# EAGLE design adapter (EAGLE 7.6.0)
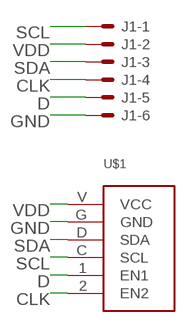
[diagram p0: schematic, sheet 1]

## Parts
J1  XF2L-0625-1  [XF2L-0625-1]
U$1  PSENSE  [PSENSE]

## Nets
CLK: J1.4 U$1.2(EN2)
D: J1.5 U$1.1(EN1)
GND: J1.6 U$1.G(GND)
SCL: J1.1 U$1.C(SCL)
SDA: J1.3 U$1.D(SDA)
VDD: J1.2 U$1.V(VCC)

## Library data of the parts
J1 = MOD_OMRON:XF2*-06?: OMRON FPC Connector Source : http://www.omron.com/ecb/products/pdf/fpc.pdf; MF: OMRON COMPONENTS USA; MPN: XF2L-0625-1; OC_FARNELL: 1536105; OC_NEWARK: 29C7842
U$1 = 445-eagle-lib:PSENSE

## Board
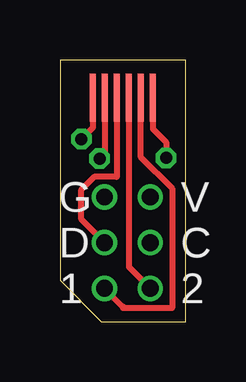
[diagram p1: board, top side]
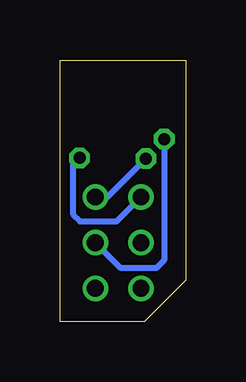
[diagram p2: board, bottom side, seen from below]

Size 5.23 x 10.91 mm. Coordinates in mm from the lower left corner, seen from the top.
Outline: 1.73,0 5.23,0 5.23,10.91 0,10.91 0,1.73 1.73,0
Copper layers (1*16): Top 0.0356mm / dielectric 1.5011mm / Bottom 0.0356mm
Design rules "LaenPCBOrder": minimum track width 6mil, minimum drill 13mil, track to track 6mil, track to pad 6mil, pad to pad 6mil, via to via 6mil, smd to smd 6mil, copper to edge 15mil, drill to drill 6mil, minimum pad ring 7mil, minimum via ring 7mil, stop-mask expansion 3mil, vias tented up to drill 0mil, thermal gap 10mil

### Footprints (pad centres in the part's own frame; a part is rotated, then mirrored left to right if it is on the bottom)
XF2L-0625-1 = smd 2 x 0.25: 1 2.405,1.25; 2 2.405,0.75; 3 2.405,0.25; 4 2.405,-0.25; 5 2.405,-0.75; 6 2.405,-1.25
PSENSE = drill 0.7: 1 0,-3.81; 2 1.905,-3.81; C 1.905,-1.905; D 0,-1.905; G 0,0; V 1.905,0

### Placement (x,y rotation side)
J1  2.62,6.93 90 top
U$1  1.85,5.21 0 top

### Tracks (layer width: path | path; a pad name or v marks a point on that pad's centre or on a via)
CLK
  Top 0.254: J1.4 2.87,2.29 U$1.2
D
  Top 0.254: U$1.1 2.62,0.64 2.62,0.58 4.67,0.58 4.67,5.56 3.37,6.87 J1.5
GND  (via drill 0.5)
  Top 0.254: v4.42,6.83 4.42,7.49 3.87,8.05 J1.6
  Bottom 0.254: U$1.G 2.87,4.19 4.39,4.19 4.67,4.47 4.67,6.58 v4.42,6.83
SCL  (via drill 0.5)
  Top 0.254: v0.89,7.62 1.37,8.1 J1.1
  Bottom 0.254: v0.89,7.62 0.89,2.56 1.22,2.24 2.69,2.24 U$1.C
SDA
  Top 0.254: U$1.D 0.89,4.27 0.89,5.51 1.42,6.04 2.36,6.04 2.37,6.05 J1.3
VDD  (via drill 0.5)
  Top 0.254: J1.2 1.87,7 1.84,7 v1.65,6.81
  Bottom 0.254: U$1.V 3.25,5.21 v1.65,6.81